# Altium schematic sheet Board-to-Board_Connector.SchDoc
size A4; SheetNumber: 8; SheetTotal: 9
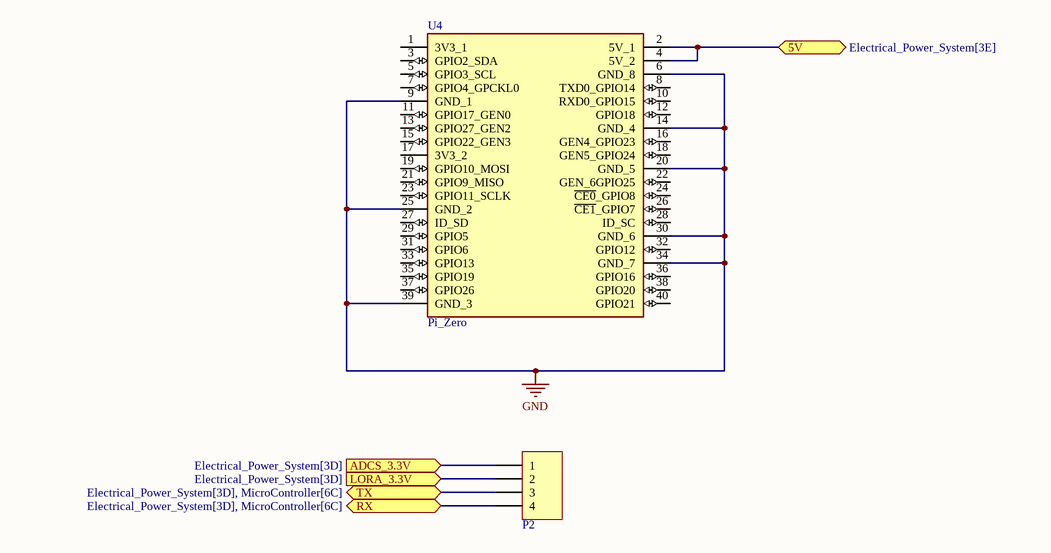
[diagram p0: Board-to-Board_Connector.SchDoc]

## Parts
P2  Header 4  [JP4]  (value not drawn)
U4  Pi_Zero  [MODULE_ADA3708]

## Ports
5V (bidir, see Electrical_Power_System[3E]), ADCS_3.3V (in, see Electrical_Power_System[3D]), LORA_3.3V (in, see Electrical_Power_System[3D]), RX (bidir, see Electrical_Power_System[3D], MicroController[6C]), TX (bidir, see Electrical_Power_System[3D], MicroController[6C])

## Nets
GND: U4.6(GND_8) U4.9(GND_1) U4.14(GND_4) U4.20(GND_5) U4.25(GND_2) U4.30(GND_6) U4.34(GND_7) U4.39(GND_3)
5V: U4.2(5V_1) U4.4(5V_2) ; port 5V
ADCS_3.3V: P2.1 ; port ADCS_3.3V
LORA_3.3V: P2.2 ; port LORA_3.3V
RX: P2.4 ; port RX
TX: P2.3 ; port TX

Not connected (* = marked no-connect by the designer): U4 1(3V3_1) 3(GPIO2_SDA) 5(GPIO3_SCL) 7(GPIO4_GPCKL0) 8(TXD0_GPIO14) 10(RXD0_GPIO15) 11(GPIO17_GEN0) 12(GPIO18) 13(GPIO27_GEN2) 15(GPIO22_GEN3) 16(GEN4_GPIO23) 17(3V3_2) 18(GEN5_GPIO24) 19(GPIO10_MOSI) 21(GPIO9_MISO) 22(GEN_6GPIO25) 23(GPIO11_SCLK) 24(~{CE0}_GPIO8) 26(~{CE1}_GPIO7) 27(ID_SD) 28(ID_SC) 29(GPIO5) 31(GPIO6) 32(GPIO12) 33(GPIO13) 35(GPIO19) 36(GPIO16) 37(GPIO26) 38(GPIO20) 40(GPIO21)

## Library data of the parts
P2 = Header 4: Header, 4-Pin; LatestRevisionDate: 17-Jul-2002; LatestRevisionNote: Re-released for DXP Platform.; Publisher: Altium Limited
U4 = Pi_Zero: Raspberry Pi Zero WH (Zero W with Headers); MF: Adafruit Industries; MP: ADA3708; SnapEDA_Link: https://www.snapeda.com/parts/ADA3708/Adafruit+Industries+LLC/view-part/?ref=snap; Package: None; Value: *; Check_prices: https://www.snapeda.com/parts/ADA3708/Adafruit+Industries+LLC/view-part/?ref=eda